# Altium schematic sheet [5]-CONNECTORS.SchDoc
size A4
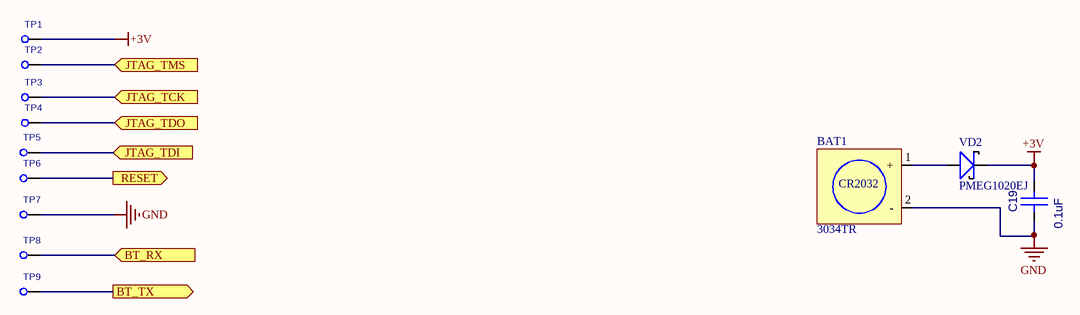
[diagram p0: [5]-CONNECTORS.SchDoc]

## Parts
BAT1  3034TR  [3034-TR]
C19  0.1uF  [CC0603]
TP1  TESTPOINT1  [TESTPOINT1]  (value not drawn)
TP2  TESTPOINT1  [TESTPOINT1]  (value not drawn)
TP3  TESTPOINT1  [TESTPOINT1]  (value not drawn)
TP4  TESTPOINT1  [TESTPOINT1]  (value not drawn)
TP5  TESTPOINT1  [TESTPOINT1]  (value not drawn)
TP6  TESTPOINT1  [TESTPOINT1]  (value not drawn)
TP7  TESTPOINT1  [TESTPOINT1]  (value not drawn)
TP8  TESTPOINT1  [TESTPOINT1]  (value not drawn)
TP9  TESTPOINT1  [TESTPOINT1]  (value not drawn)
VD2  PMEG1020EJ  [SOD323]

## Ports
BT_RX (in), BT_TX (out), JTAG_TCK (in), JTAG_TDI (in), JTAG_TDO (in), JTAG_TMS (in), RESET (out)

## Nets
+3V: C19.2(B) TP1.1 VD2.2(K)
GND: BAT1.2(-) C19.1(A) TP7.1
BT_RX: TP8.1 ; port BT_RX
BT_TX: TP9.1 ; port BT_TX
JTAG_TCK: TP3.1 ; port JTAG_TCK
JTAG_TDI: TP5.1 ; port JTAG_TDI
JTAG_TDO: TP4.1 ; port JTAG_TDO
JTAG_TMS: TP2.1 ; port JTAG_TMS
RESET: TP6.1 ; port RESET
NetBAT1_1: BAT1.1(+) VD2.1(A)

## Notes on the sheet
- (in symbol 3034) CR2032

## Library data of the parts
BAT1 = 3034: CR2032 holder smd; Value: 3034TR
C19 = CC0603: Value: 0.1uF
VD2 = PMEG2010: Value: PMEG1020EJ
TP1-TP9 = TESTPOINT1: Value: *